# EAGLE design interface (EAGLE 8.3.2)
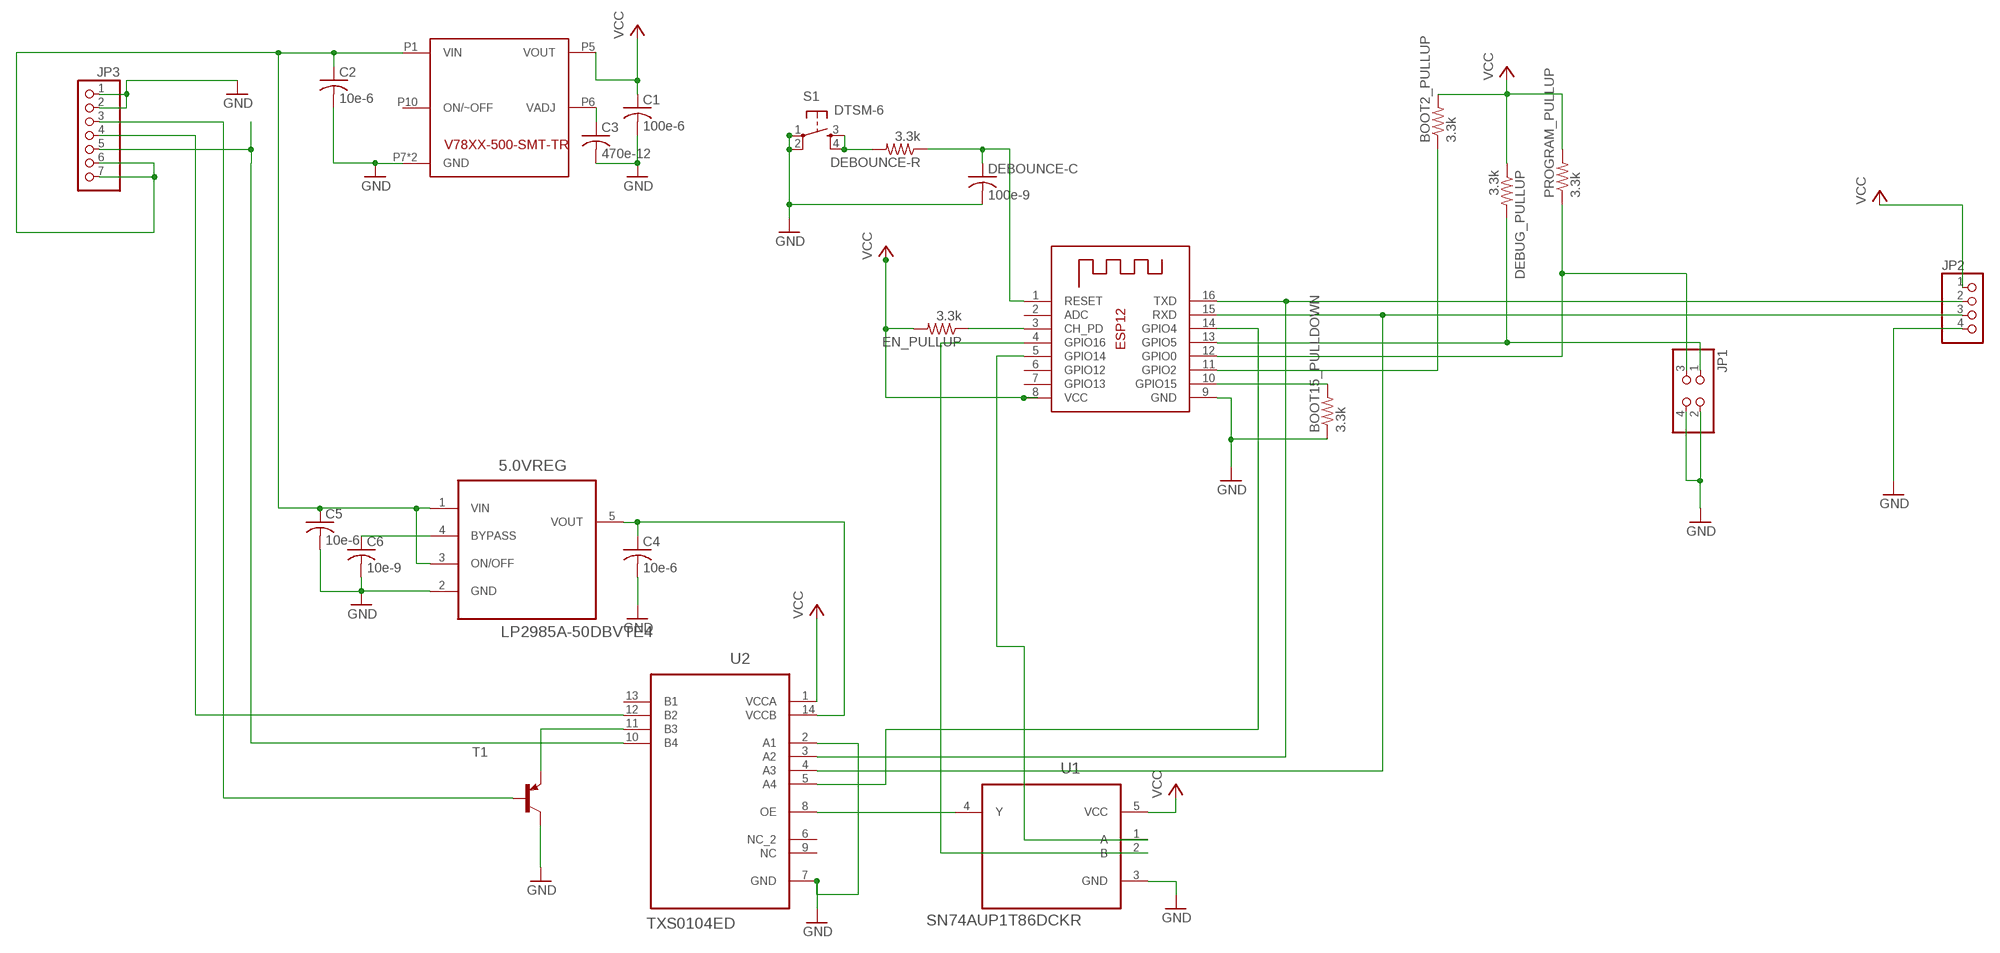
[diagram p0: schematic, sheet 1]

## Parts
5.0VREG  LP2985A-50DBVTE4  LP2985A-33DBVTE4  [SOT95P280X145-5N]
BOOT2_PULLUP  3.3k  R-US_R0603  [R0603]
BOOT15_PULLDOWN  3.3k  R-US_R0603  [R0603]
C1  100e-6  C-USC0603  [C0603]
C2  10e-6  C-USC0603  [C0603]
C3  470e-12  C-USC0603  [C0603]
C4  10e-6  C-USC0603  [C0603]
C5  10e-6  C-USC0603  [C0603]
C6  10e-9  C-USC0603  [C0603]
DEBOUNCE-C  100e-9  C-USC0603  [C0603]
DEBOUNCE-R  3.3k  R-US_R0603  [R0603]
DEBUG_PULLUP  3.3k  R-US_R0603  [R0603]
EN_PULLUP  3.3k  R-US_R0603  [R0603]
JP1  PINHD-2X2  [2X02]
JP2  PINHD-1X4  [1X04]
JP3  PINHD-1X7  [1X07]
PROGRAM_PULLUP  3.3k  R-US_R0603  [R0603]
S1  DTSM-6  [DTSM-6]
T1  MMBT2907ALT1-PNP-SOT23-BEC  [SOT23-BEC]
U1  SN74AUP1T86DCKR  [SOT65P210X110-5N]
U2  TXS0104ED  [SOIC127P600X175-14N]
U$1  V78XX-500-SMT-TR/SMD10-6  [SMD-10/6]
X1  ESP-12  [ESP-12]

## Nets
5VSUPPLY: 5.0VREG.5(VOUT) C4.1 U2.14(VCCB)
BATT+: 5.0VREG.1(VIN) 5.0VREG.3(ON/OFF) C2.1 C5.1 JP3.6 JP3.7 U$1.P1(VIN)
BOOT2: BOOT2_PULLUP.1 X1.11(GPIO2)
BOOT15: BOOT15_PULLDOWN.2 X1.10(GPIO15)
DEBUG: DEBUG_PULLUP.2 JP1.1 X1.13(GPIO5)
ESPBRC: U2.5(A4) X1.14(GPIO4)
ESPRX: JP2.3 U2.4(A3) X1.15(RXD)
ESPTX: JP2.2 U2.3(A2) X1.16(TXD)
GND: 5.0VREG.2(GND) BOOT15_PULLDOWN.1 C1.2 C2.2 C3.2 C4.2 C5.2 C6.2 DEBOUNCE-C.2 JP1.2 JP1.4 JP2.4 JP3.1 JP3.2 S1.1 S1.2 T1.C U1.3(GND) U2.2(A1) U2.7(GND) U$1.P7(GND) U$1.P9(GND) X1.9(GND)
N$1: C3.1 U$1.P6(VADJ)
N$4: EN_PULLUP.1 X1.3(CH_PD)
N$7: 5.0VREG.4(BYPASS) C6.1
N$20: U1.2(B) X1.4(GPIO16)
N$21: U1.1(A) X1.5(GPIO14)
PROGRAM: JP1.3 PROGRAM_PULLUP.1 X1.12(GPIO0)
ROOMBABRC: JP3.5 U2.10(B4)
ROOMBARX: JP3.4 U2.12(B2)
ROOMBATX: JP3.3 T1.B
ROOMBATXBOOST: T1.E U2.11(B3)
RST: DEBOUNCE-C.1 DEBOUNCE-R.1 X1.1(RESET)
RSTPRESS: DEBOUNCE-R.2 S1.3 S1.4
SERENABLE: U1.4(Y) U2.8(OE)
VCC: BOOT2_PULLUP.2 C1.1 DEBUG_PULLUP.1 EN_PULLUP.2 JP2.1 PROGRAM_PULLUP.2 U1.5(VCC) U2.1(VCCA) U$1.P5(VOUT) X1.8(VCC)
Unconnected: U2.6(NC_2) U2.9(NC) U2.13(B1) U$1.P10(ON/~OFF) X1.2(ADC) X1.6(GPIO12) X1.7(GPIO13)

## Library data of the parts
5.0VREG = Texas Instruments_By_element14_Batch_1:LP2985A-33DBVTE4: 150-mA LOW-NOISE LOW-DROPOUT REGULATOR WITH SHUTDOWN; MPN: LP2985A-33DBVTE4; OC_FARNELL: 1053660; OC_NEWARK: 79K3928; PACKAGE: SOT-23-5; SUPPLIER: Texas Instruments
BOOT2_PULLUP BOOT15_PULLDOWN DEBOUNCE-R DEBUG_PULLUP EN_PULLUP PROGRAM_PULLUP = rcl:R-US_: RESISTOR, American symbol
C1-C6 DEBOUNCE-C = rcl:C-US: CAPACITOR, American symbol
JP1 = pinhead:PINHD-2X2: PIN HEADER
JP2 = pinhead:PINHD-1X4: PIN HEADER
JP3 = pinhead:PINHD-1X7: PIN HEADER
S1 = switch-tact:DTSM-6
T1 = transistor:*-PNP-: PNP Transistror
U1 = Texas Instruments_By_element14_Batch_1:SN74AUP1T86DCKR: EXCLUSIVE-OR GATE; MPN: SN74AUP1T86DCKR; OC_FARNELL: -; OC_NEWARK: 74R6563; PACKAGE: SC70-5; SUPPLIER: Texas Instruments
U2 = Texas Instruments_By_element14_Batch_1:TXS0104ED: 4-BIT BIDIRECTIONAL VOLTAGE-LEVEL TRANSLATOR FOR OPEN-DRAIN AND PUSH-PULL APPLICATIONS; MPN: TXS0104ED; OC_FARNELL: 1607892; OC_NEWARK: 10M0686; PACKAGE: SOIC-14; SUPPLIER: TEXAS INSTRUMENTS
U$1 = CUI-power-supplies:V78XX-500-SMT-TR/SMD10-6
X1 = adafruit:ESP-12

## Module CUI-V78XX-500-SMT-TR
Ports: 
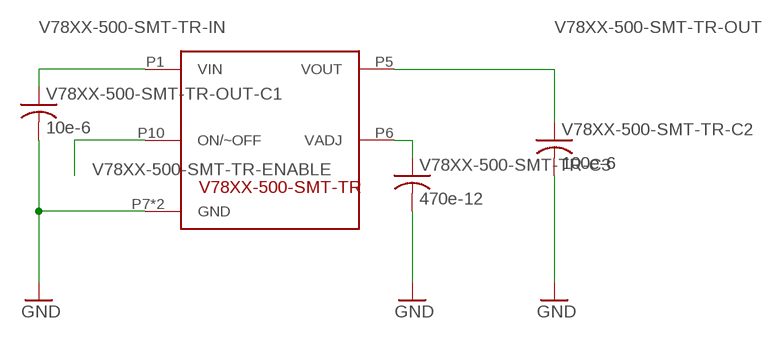
[diagram p1: schematic, module CUI-V78XX-500-SMT-TR, sheet 1]

### Parts
U$1  V78XX-500-SMT-TR/SMD10-6  [SMD-10/6]
V78XX-500-SMT-TR-C2  100e-6  C-USC0603  [C0603]
V78XX-500-SMT-TR-C3  470e-12  C-USC0603  [C0603]
V78XX-500-SMT-TR-OUT-C1  10e-6  C-USC0603  [C0603]

### Nets
GND: U$1.P7(GND) U$1.P9(GND) V78XX-500-SMT-TR-C2.2 V78XX-500-SMT-TR-C3.2 V78XX-500-SMT-TR-OUT-C1.2
V78XX-500-SMT-TR-ADJ: U$1.P6(VADJ) V78XX-500-SMT-TR-C3.1
V78XX-500-SMT-TR-ENABLE: U$1.P10(ON/~OFF)
V78XX-500-SMT-TR-IN: U$1.P1(VIN) V78XX-500-SMT-TR-OUT-C1.1
V78XX-500-SMT-TR-OUT: U$1.P5(VOUT) V78XX-500-SMT-TR-C2.1

### Library data of the parts
U$1 = CUI-power-supplies:V78XX-500-SMT-TR/SMD10-6
V78XX-500-SMT-TR-C2 V78XX-500-SMT-TR-C3 V78XX-500-SMT-TR-OUT-C1 = rcl:C-US: CAPACITOR, American symbol

## Board
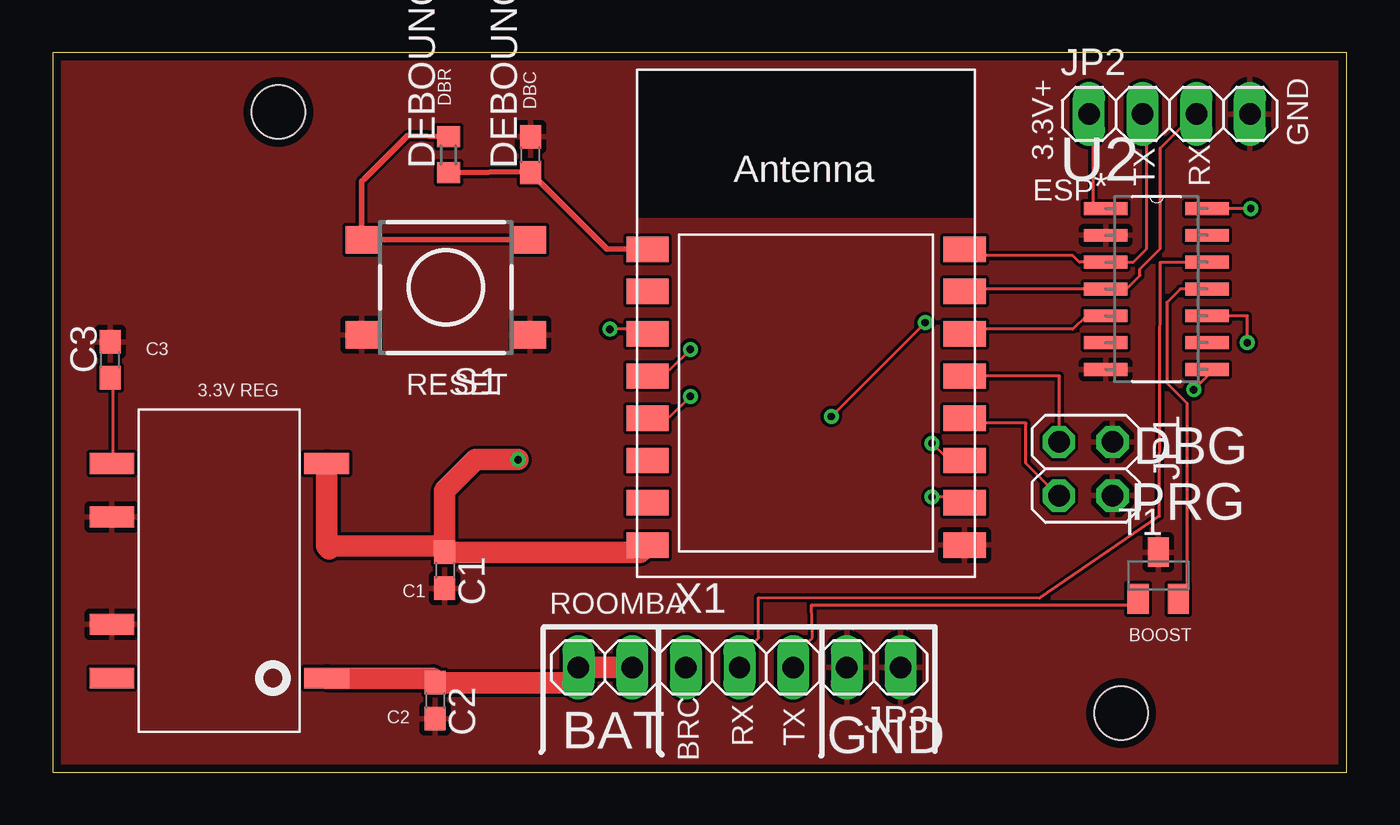
[diagram p2: board, top side]
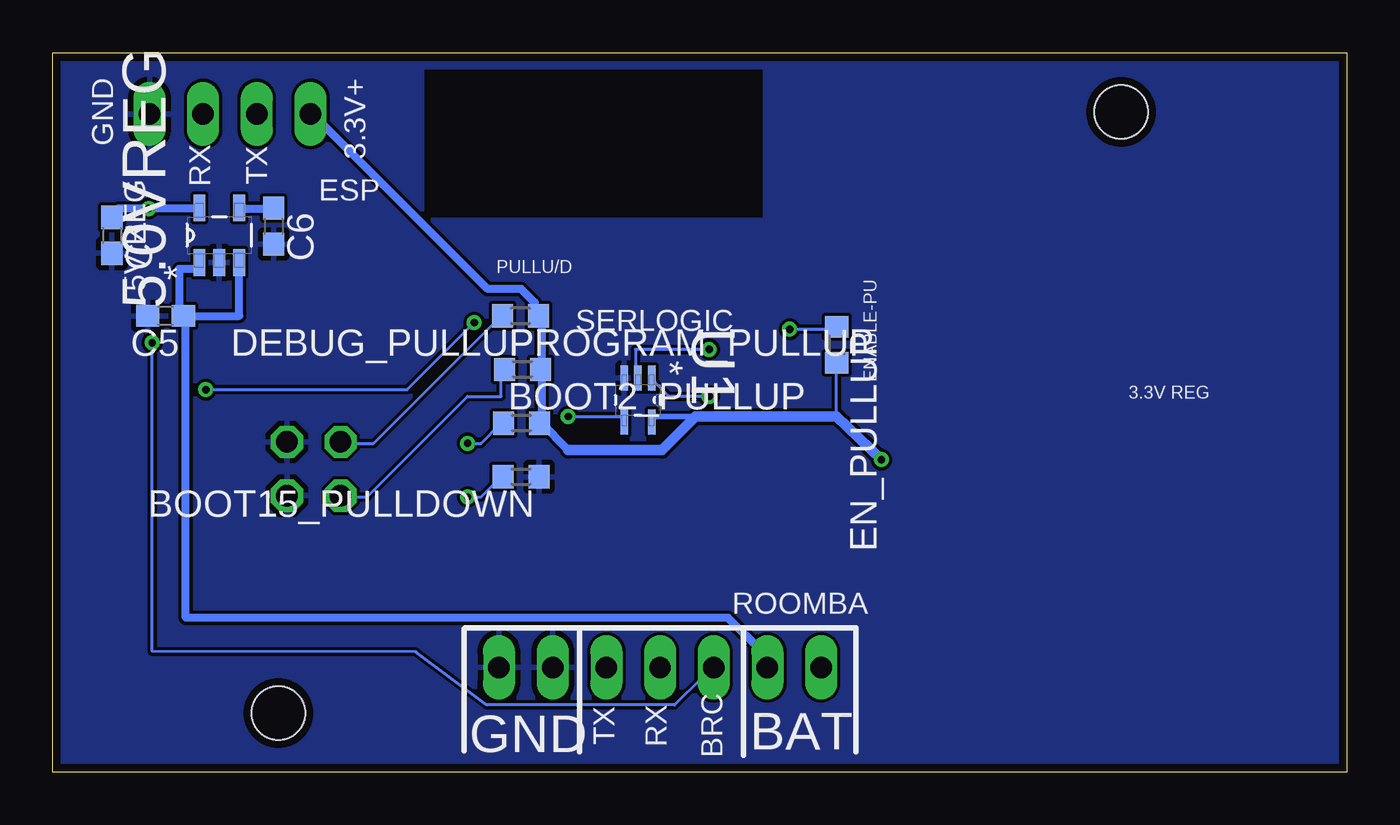
[diagram p3: board, bottom side, seen from below]

Size 61.21 x 34.04 mm. Coordinates in mm from the lower left corner, seen from the top.
Outline: 0,0 61.21,0 61.21,34.04 0,34.04 0,0
Copper layers (1*16): Top 0.0356mm / dielectric 1.5011mm / Bottom 0.0356mm
Design rules "LaenPCBOrder": minimum track width 6mil, minimum drill 13mil, track to track 6mil, track to pad 6mil, pad to pad 6mil, via to via 6mil, smd to smd 6mil, copper to edge 15mil, drill to drill 6mil, minimum pad ring 7mil, minimum via ring 7mil, stop-mask expansion 3mil, vias tented up to drill 0mil, thermal gap 10mil
Holes 2.54 mm at 10.67,31.24 50.55,2.79

### Footprints (pad centres in the part's own frame; a part is rotated, then mirrored left to right if it is on the bottom)
SOT95P280X145-5N = smd 1.27 x 0.559: 1 -1.295,0.94; 2 -1.295,0; 3 -1.295,-0.94; 4 1.295,-0.94; 5 1.295,0.94
R0603 = smd 1 x 1.1: 1 -0.85,0; 2 0.85,0
C0603 = smd 1.1 x 1: 1 -0.85,0; 2 0.85,0
2X02 = drill 1.016 octagon: 1 -1.27,-1.27; 2 -1.27,1.27; 3 1.27,-1.27; 4 1.27,1.27
1X04 = drill 1.016 long: 1 -3.81,0; 2 -1.27,0; 3 1.27,0; 4 3.81,0
1X07 = drill 1.016 long: 1 -7.62,0; 2 -5.08,0; 3 -2.54,0; 4 0,0; 5 2.54,0; 6 5.08,0; 7 7.62,0
DTSM-6 = smd 1.55 x 1.3: 1 -3.975,2.25; 2 3.975,2.25; 3 -3.975,-2.25; 4 3.975,-2.25
SOT23-BEC = smd 1 x 1.4: B -0.95,-1.1; C 0,1.1; E 0.95,-1.1
SOT65P210X110-5N = smd 1.168 x 0.356: 1 -1.041,0.66; 2 -1.041,0; 3 -1.041,-0.66; 4 1.041,-0.66; 5 1.041,0.66
SOIC127P600X175-14N = smd 2.057 x 0.61: 1 -4.801,7.62; 2 -4.801,6.35; 3 -4.801,5.08; 4 -4.801,3.81; 5 -4.801,2.54; 6 -4.801,1.27; 7 -4.801,0; 8 0,0; 9 0,1.27; 10 0,2.54; 11 0,3.81; 12 0,5.08; 13 0,6.35; 14 0,7.62
SMD-10/6 = smd 0.991 x 2.108: P1 -5.08,-5.08; P5 5.08,-5.08; P6 5.08,5.08; P7 2.54,5.08; P9 -2.54,5.08; P10 -5.08,5.08
ESP-12 = smd 2 x 1.2: 1 -7.5,4.5; 2 -7.5,2.5; 3 -7.5,0.5; 4 -7.5,-1.5; 5 -7.5,-3.5; 6 -7.5,-5.5; 7 -7.5,-7.5; 8 -7.5,-9.5; 9 7.5,-9.5; 10 7.5,-7.5; 11 7.5,-5.5; 12 7.5,-3.5; 13 7.5,-1.5; 14 7.5,0.5; 15 7.5,2.5; 16 7.5,4.5

### Placement (x,y rotation side)
5.0VREG  53.34,25.4 90 bottom
BOOT2_PULLUP  39.04,16.51 0 bottom
BOOT15_PULLDOWN  39.07,13.97 180 bottom
C1  18.54,9.55 270 top
C2  18.08,3.38 270 top
C3  2.72,19.51 90 top
C4  58.42,25.4 270 bottom
C5  55.88,21.59 180 bottom
C6  50.77,25.83 270 bottom
DEBOUNCE-C  22.61,29.21 90 top
DEBOUNCE-R  18.72,29.21 90 top
DEBUG_PULLUP  39.09,21.59 180 bottom
EN_PULLUP  24.13,20.22 270 bottom
JP1  48.87,14.35 270 top
JP2  52.83,31.14 0 top
JP3  32.49,4.95 180 top
PROGRAM_PULLUP  38.99,19.05 0 bottom
S1  18.59,22.94 180 top
T1  52.3,9.3 0 top
U1  33.53,17.6 270 bottom
U2  54.61,19.05 0 top
U$1  7.87,9.53 90 top
X1  35.64,20.24 0 top

### Tracks (layer width: path | path; a pad name or v marks a point on that pad's centre or on a via)
5VSUPPLY  (via drill 0.35)
  Top 0.152: v56.68,26.67 U2.14
  Bottom 0.152: 58.1,26.67 58.42,26.35 C4.1 | 54.29,26.67 5.0VREG.5
  Bottom 0.381: 54.29,26.67 v56.68,26.67 58.1,26.67
BATT+
  Top 0.152: 17.78,4.45 C2.1 18.09,4.34 18.1,4.45 | JP3.6 27.36,5.08 | 24.82,4.45 24.82,4.76 JP3.7
  Top 1.016: U$1.P1 17.99,4.45 18.09,4.34 | C2.1 24.6,4.23 24.82,4.45 | JP3.7 JP3.6
  Bottom 0.152: 55.24,21.59 C5.1 54.93,21.59 | 54.29,23.81 5.0VREG.1 | 52.39,23.81 5.0VREG.3 | 27.67,5.71 27.67,5.08 JP3.6
  Bottom 0.381: 55.24,21.59 55.24,23.81 54.29,23.81 | 52.39,23.81 52.39,21.59 54.93,21.59 54.93,7.3 29.26,7.3 27.67,5.71
BOOT2  (via drill 0.35)
  Top 0.152: v41.59,15.56 42.23,14.92 42.86,14.92 X1.11
  Bottom 0.152: v41.59,15.56 40.96,15.56 40.01,16.51 BOOT2_PULLUP.1
BOOT15  (via drill 0.35)
  Top 0.152: v41.59,13.02 42.86,13.02 X1.10
  Bottom 0.152: v41.59,13.02 40.96,13.02 40.01,13.97 BOOT15_PULLDOWN.2
DEBUG
  Top 0.152: X1.13 43.18,18.73 47.62,18.73 47.62,15.88 JP1.1
  Bottom 0.152: DEBUG_PULLUP.2 40.01,21.59 46.04,15.56 47.31,15.56 JP1.1
ESPBRC
  Top 0.152: U2.5 48.9,21.59 48.26,20.95 43.18,20.95 X1.14
ESPRX
  Top 0.152: X1.15 43.18,22.86 U2.4 50.8,22.86 51.44,23.5 51.44,23.81 52.39,24.77 52.39,29.53 53.98,31.11 JP2.3
ESPTX
  Top 0.152: X1.16 43.18,24.45 48.26,24.45 48.58,24.13 U2.3 51.12,24.13 51.75,24.77 51.75,31.11 JP2.2
GND
  pour Top: 0,0 61.21,0 61.21,34.04 0.05,33.93
  pour Bottom: 61.21,0 0,0 0,34.04 61.21,34.04
N$1
  Top 0.152: C3.1 2.86,18.41 2.86,14.61 U$1.P6
N$4  (via drill 0.35)
  Top 0.152: v26.35,20.95 27.94,20.95 X1.3
  Bottom 0.152: v26.35,20.95 24.13,20.95 EN_PULLUP.1
N$7
  Bottom 0.152: 50.8,26.67 C6.1 | 52.39,26.67 5.0VREG.4
  Bottom 0.381: 52.39,26.67 50.8,26.67
N$20  (via drill 0.35)
  Top 0.152: v30.16,20 29.21,19.05 28.26,19.05 X1.4
  Bottom 0.152: v30.16,20 33.66,20 33.66,18.73 U1.2
N$21  (via drill 0.35)
  Top 0.152: v30.16,17.78 29.21,16.83 28.26,16.83 X1.5
  Bottom 0.152: v30.16,17.78 32.07,17.78 32.7,18.41 U1.1
PROGRAM
  Top 0.152: X1.12 43.18,16.51 46.04,16.51 46.04,14.61 47.31,13.34 JP1.3
  Bottom 0.152: PROGRAM_PULLUP.1 40.01,19.05 40.01,17.78 41.59,17.78 46.35,13.02 47.31,13.02 JP1.3
ROOMBABRC  (via drill 0.35)
  Top 0.152: U2.10 56.52,21.59 v56.52,20.32
  Bottom 0.152: v56.52,20.32 56.52,5.71 44.04,5.69 40.69,3.17 31.8,3.17 30.53,4.45 JP3.5
ROOMBARX
  Top 0.152: U2.12 52.39,24.13 52.36,12.12 46.7,8.23 33.39,8.26 33.39,6.35 32.75,5.71 32.75,5.08 JP3.4
ROOMBATX
  Top 0.152: T1.B 51.09,7.91 35.9,7.91 35.93,6.35 35.29,5.71 35.29,5.08 JP3.3
ROOMBATXBOOST
  Top 0.152: U2.11 53.34,22.86 52.7,22.23 52.7,18.41 53.66,17.46 53.66,8.57 53.34,8.26 T1.E
RST
  Top 0.254: X1.1 26.22,24.74 DEBOUNCE-C.1 22.55,28.41 DEBOUNCE-R.1
RSTPRESS
  Top 0.254: S1.3 S1.4 14.62,27.95 14.73,28.07 14.82,28.16 16.78,30.11 DEBOUNCE-R.2
SERENABLE  (via drill 0.35)
  Top 0.152: v41.27,21.27 v36.83,16.83 | v53.98,18.1 54.61,18.73 U2.8
  Bottom 0.152: v36.83,16.83 34.29,16.83 U1.4 | v41.27,21.27 44.45,18.1 v53.98,18.1
VCC  (via drill 0.35)
  Top 0.152: 13.02,14.61 U$1.P5 | 21.69,15.1 v22.01,14.78 | X1.8 27.94,10.79 | U2.1 49.53,26.67 49.21,26.99 49.21,31.11 JP2.1
  Top 1.016: U$1.P5 12.95,10.69 | 12.95,10.69 13.08,10.57 | v22.01,14.78 20,14.78 18.54,13.32 C1.1 | 12.95,10.69 18.25,10.69 C1.1 | C1.1 27.79,10.4 X1.8
  Bottom 0.152: 38.1,21.59 DEBUG_PULLUP.1 38.42,21.59 38.42,22.23 | 38.1,19.05 PROGRAM_PULLUP.2 | 24.13,16.83 EN_PULLUP.2 | 32.7,16.83 U1.5 | 38.1,16.51 BOOT2_PULLUP.2 | 48.9,31.11 JP2.1
  Bottom 0.254: 32.7,16.83 30.8,16.83
  Bottom 0.381: 38.1,21.59 38.1,19.05 38.1,16.51 36.83,15.24 | 48.9,31.11 40.64,22.86 39.05,22.86 38.42,22.23
  Bottom 0.508: 36.83,15.24 32.38,15.24 30.8,16.83 24.13,16.83 v22.01,14.78

### Text on the board
tPlace: DBR | DBC | GND | 3.3V+ | TX | RX | ESP | C3 | 3.3V REG | RESET | DBG | PRG | C1 | ROOMBA | BOOST | C2 | BAT | BRC | RX | TX | GND
bPlace: GND | 3.3V+ | TX | RX | 5V REG | ESP | PULLU/D | SERLOGIC | 3.3V REG | ENABLE-PU | ROOMBA | BAT | BRC | RX | TX | GND